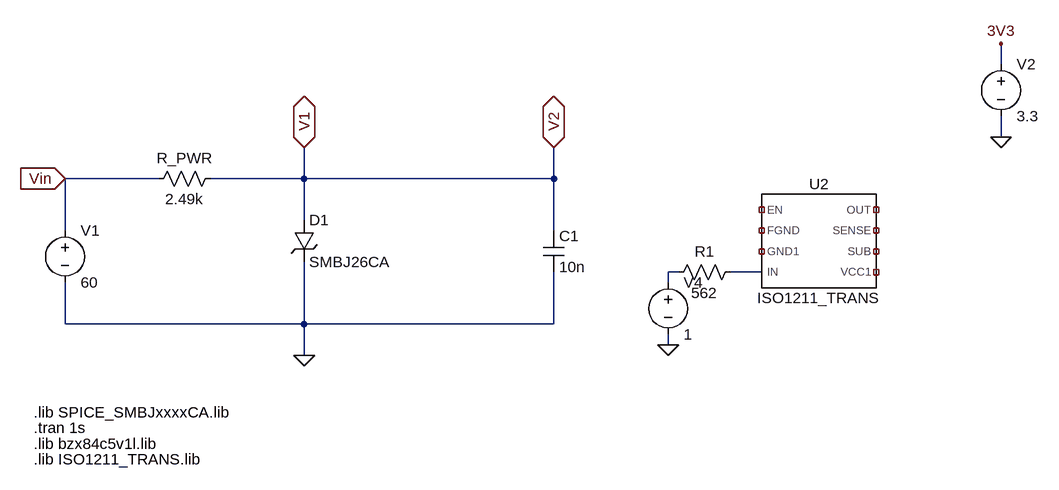
[diagram p0: schematic tvs_test1.asc]
tvs_test1.asc, the LTspice schematic file:
Version 4
SHEET 1 1840 900
WIRE 1216 -256 1216 -288
WIRE 1216 -144 1216 -176
WIRE -80 -80 -224 -80
WIRE 144 -80 144 -128
WIRE 144 -80 0 -80
WIRE 528 -80 528 -128
WIRE 528 -80 144 -80
WIRE 144 -16 144 -80
WIRE -224 0 -224 -80
WIRE 528 0 528 -80
WIRE 720 64 704 64
WIRE 848 64 800 64
WIRE 704 80 704 64
WIRE -224 144 -224 80
WIRE 144 144 144 48
WIRE 144 144 -224 144
WIRE 528 144 528 64
WIRE 528 144 144 144
WIRE 704 176 704 160
WIRE 144 192 144 144
FLAG 144 -128 V1
IOPIN 144 -128 BiDir
FLAG 528 -128 V2
IOPIN 528 -128 BiDir
FLAG 144 192 0
FLAG -224 -80 Vin
IOPIN -224 -80 In
FLAG 1216 -144 0
FLAG 1216 -288 3V3
FLAG 704 176 0
SYMBOL res 16 -96 R90
WINDOW 0 0 56 VBottom 2
WINDOW 3 32 56 VTop 2
SYMATTR InstName R_PWR
SYMATTR Value 2.49k
SYMBOL ISO1211_TRANS 928 16 R0
SYMATTR InstName U2
SYMBOL voltage 1216 -272 R0
SYMATTR InstName V2
SYMATTR Value 3.3
SYMBOL voltage -224 -16 R0
WINDOW 123 0 0 Left 0
WINDOW 39 0 0 Left 0
SYMATTR InstName V1
SYMATTR Value 60
SYMBOL TVSdiode 128 -16 R0
SYMATTR InstName D1
SYMATTR Value SMBJ26CA
SYMATTR Prefix X
SYMBOL cap 512 0 R0
SYMATTR InstName C1
SYMATTR Value 10n
SYMBOL res 816 48 R90
WINDOW 0 0 56 VBottom 2
WINDOW 3 32 56 VTop 2
SYMATTR InstName R1
SYMATTR Value 562
SYMBOL voltage 704 64 R0
SYMATTR InstName V4
SYMATTR Value 1
TEXT -272 280 Left 2 !.lib SPICE_SMBJxxxxCA.lib
TEXT -272 304 Left 2 !.tran 1s
TEXT -272 328 Left 2 !.lib bzx84c5v1l.lib
TEXT -272 352 Left 2 !.lib ISO1211_TRANS.lib

The netlist it stands for:
* tvs_test1.asc
R_PWR V2 Vin 2.49k
XU2 NC_01 NC_02 NC_03 N002 NC_04 NC_05 NC_06 NC_07 ISO1211_TRANS  ; pins EN FGND GND1 IN OUT SENSE SUB VCC1
V2 3V3 0 3.3
V1 Vin 0 60
XD1 V2 0 SMBJ26CA  ; pins + -
C1 V2 0 10n
R1 N002 N001 562
V4 N001 0 1
.lib SPICE_SMBJxxxxCA.lib
.tran 1s
.lib bzx84c5v1l.lib
.lib ISO1211_TRANS.lib
.lib C:\Users\Vladimir Villamizar\Downloads\Digital Input\TVS_diode_test - Copy\ISO1211_TRANS.LIB
.backanno
.end